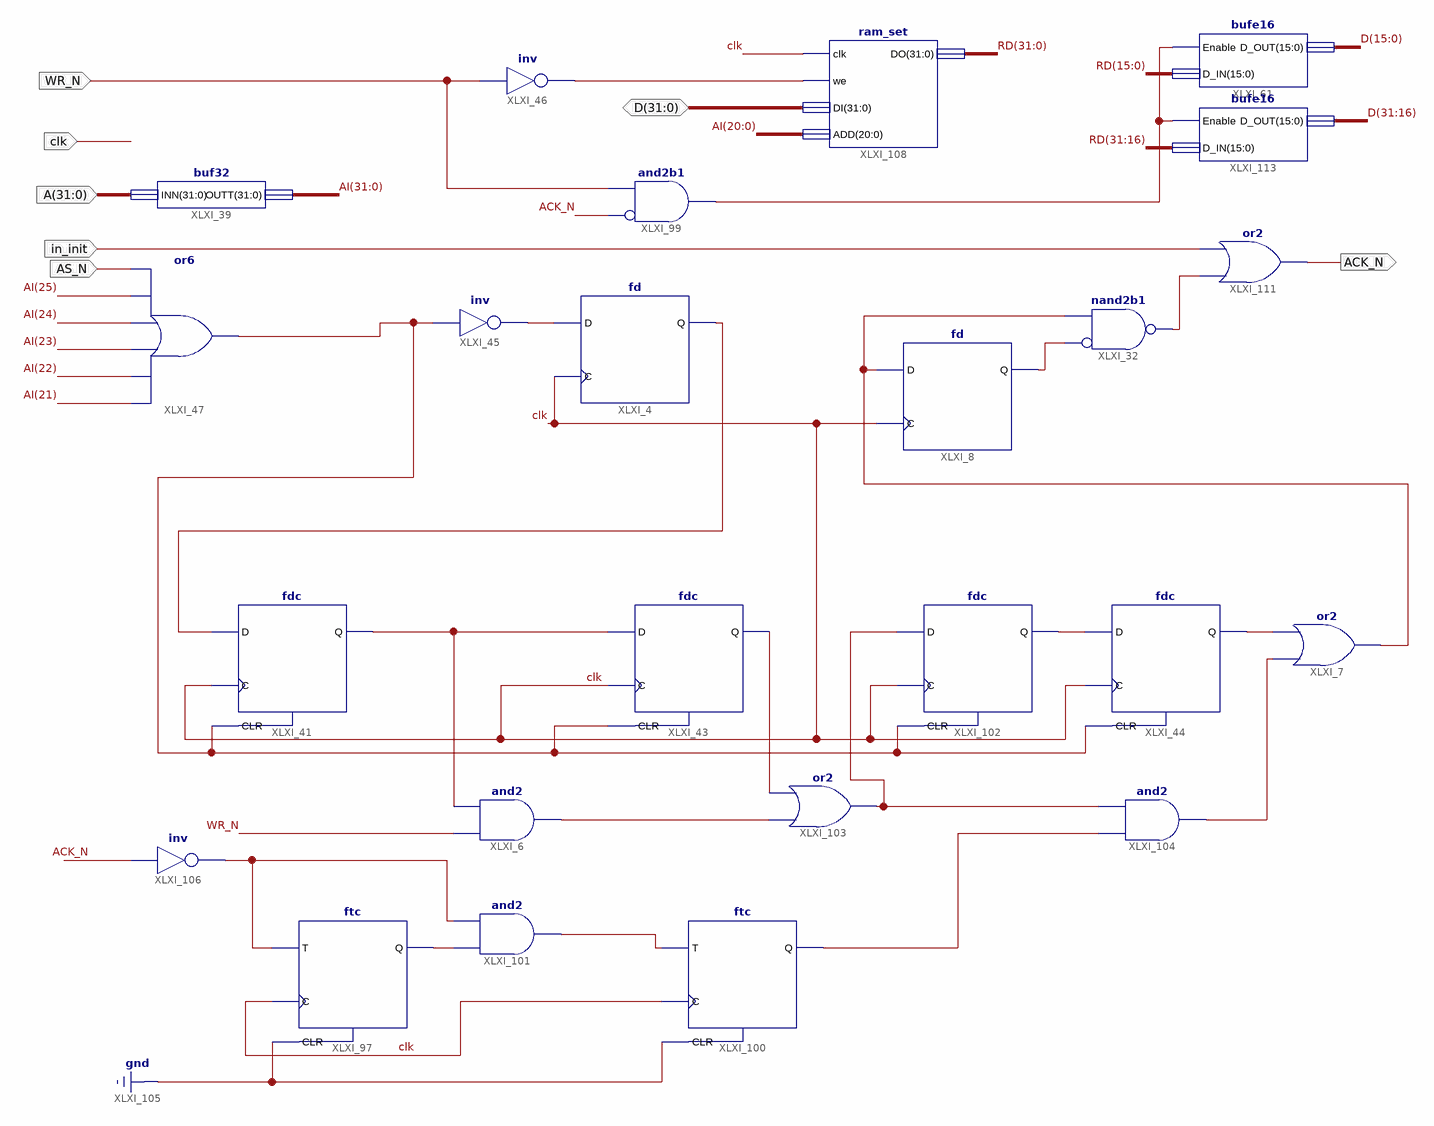
[diagram p0: schematic sheet 1]
// Xilinx ISE schematic slave_set.sch (spartan3) as structural Verilog: 24 symbols, 7 ports
module slave_set (
  input  clk,
  input  WR_N,
  input  [31:0] A,
  input  AS_N,
  input  in_init,
  inout  [31:0] D,
  output ACK_N
);

  wire XLXN_30, XLXN_31, XLXN_52, XLXN_58, XLXN_73, XLXN_79, XLXN_187, XLXN_191, XLXN_193, XLXN_210,
       XLXN_211, XLXN_212, XLXN_220, XLXN_221, XLXN_222, XLXN_223, XLXN_226, XLXN_251, XLXN_254;
  wire [31:0] AI, RD;

  not XLXI_46 (XLXN_79, WR_N);
  and XLXI_6 (XLXN_212, WR_N, XLXN_52);
  not XLXI_45 (XLXN_73, XLXN_251);
  fd XLXI_4 (.C(clk), .D(XLXN_73), .Q(XLXN_58));
  fdc XLXI_43 (.C(clk), .CLR(XLXN_251), .D(XLXN_52), .Q(XLXN_210));
  fdc XLXI_44 (.C(clk), .CLR(XLXN_251), .D(XLXN_223), .Q(XLXN_220));
  fdc XLXI_41 (.C(clk), .CLR(XLXN_251), .D(XLXN_58), .Q(XLXN_52));
  buf32 XLXI_39 (.INN(A), .OUTT(AI));
  nand XLXI_32 (XLXN_254, ~XLXN_30, XLXN_31);  // nand2b1
  fd XLXI_8 (.C(clk), .D(XLXN_31), .Q(XLXN_30));
  ftc XLXI_97 (.C(clk), .CLR(1'b0), .T(XLXN_226), .Q(XLXN_191));
  ftc XLXI_100 (.C(clk), .CLR(1'b0), .T(XLXN_193), .Q(XLXN_222));
  and XLXI_101 (XLXN_193, XLXN_191, XLXN_226);
  fdc XLXI_102 (.C(clk), .CLR(XLXN_251), .D(XLXN_211), .Q(XLXN_223));
  or XLXI_103 (XLXN_211, XLXN_212, XLXN_210);
  or XLXI_7 (XLXN_31, XLXN_221, XLXN_220);
  and XLXI_104 (XLXN_221, XLXN_222, XLXN_211);
  not XLXI_106 (XLXN_226, ACK_N);
  ram_set XLXI_108 (.clk(clk), .we(XLXN_79), .DI(D), .ADD(AI[20:0]), .DO(RD));
  or XLXI_47 (XLXN_251, AI[21], AI[22], AI[23], AI[24], AI[25], AS_N);
  or XLXI_111 (ACK_N, XLXN_254, in_init);
  bufe16 XLXI_61 (.Enable(XLXN_187), .D_IN(RD[15:0]), .D_OUT(D[15:0]));
  bufe16 XLXI_113 (.Enable(XLXN_187), .D_IN(RD[31:16]), .D_OUT(D[31:16]));
  and XLXI_99 (XLXN_187, ~ACK_N, WR_N);  // and2b1
endmodule
